# Altium schematic sheet Debug.SchDoc
size Letter; SheetNumber: 11; SheetTotal: 11
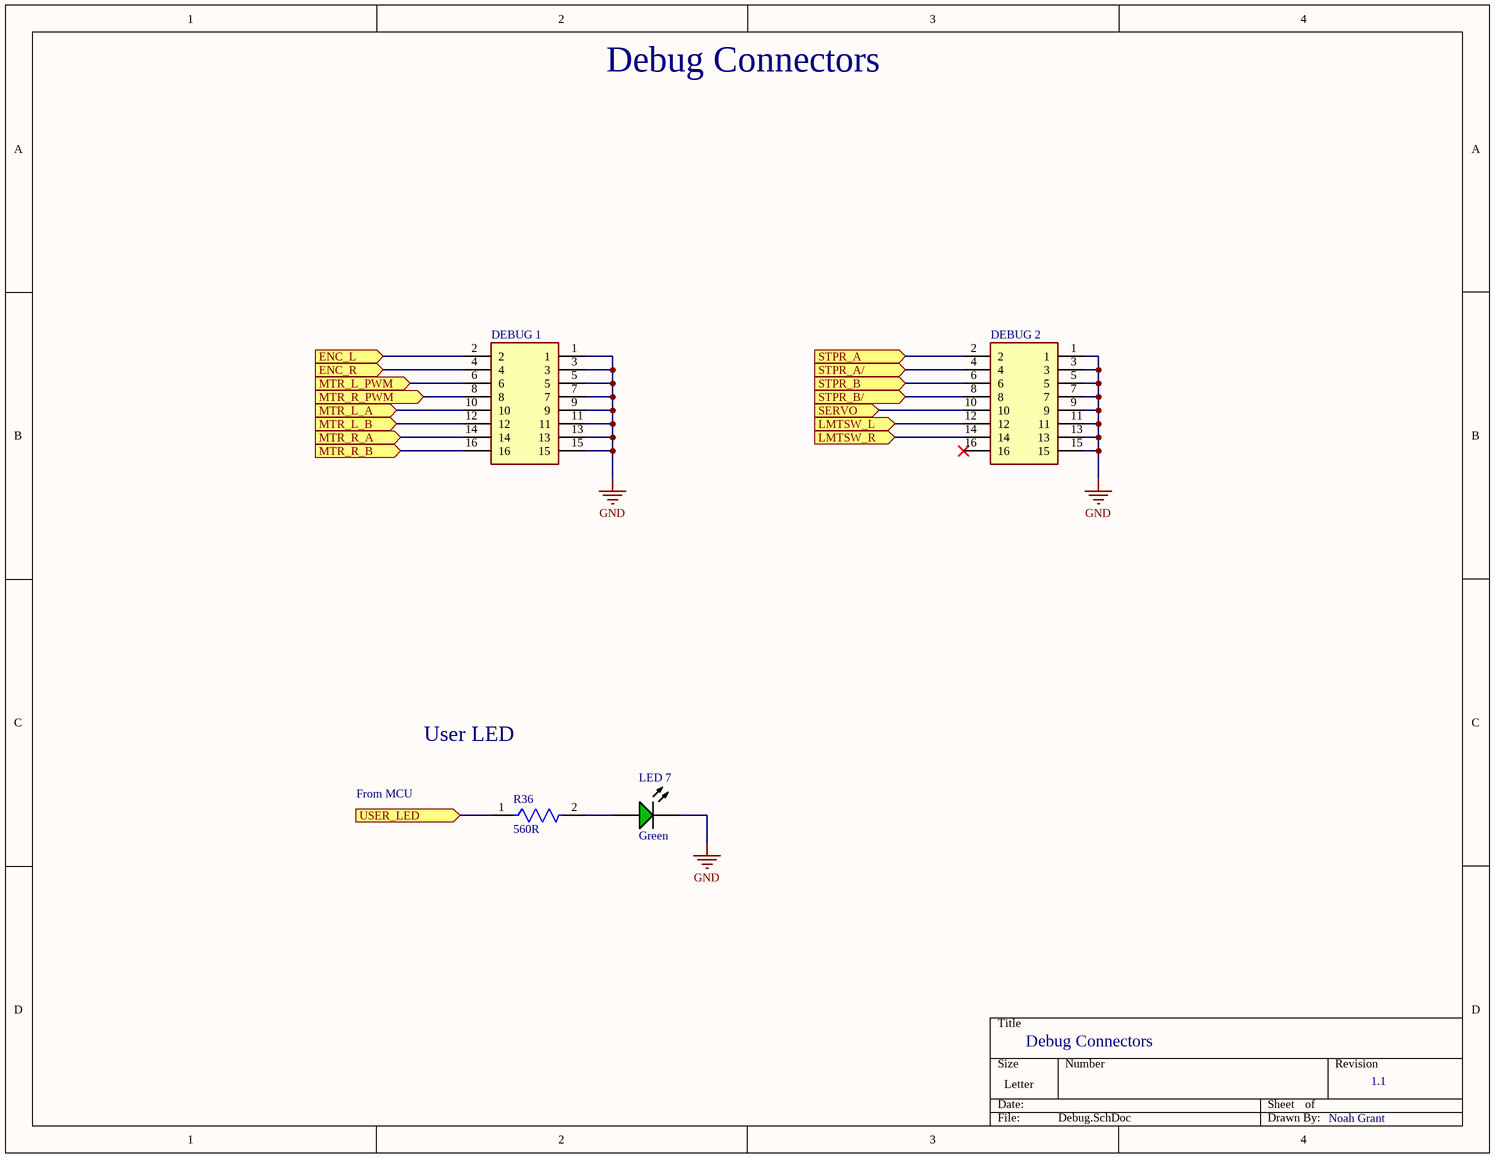
[diagram p0: Debug.SchDoc]

## Parts
DEBUG_1  3020-16-0300-00  [302016030000]  (value not drawn)
DEBUG_2  3020-16-0300-00  [302016030000]  (value not drawn)
LED_7  Green  [AVAG-HSMX-C190_V]
R36  560R  [FP-CPF0603-MFG]

## Ports
ENC_L (in, see Top_Sheet[2D], DCMTR_ENC[2B], Nucleo[2C]), ENC_R (in, see Top_Sheet[2D], DCMTR_ENC[1A], Nucleo[2C]), LMTSW_L (in, see Top_Sheet[2D], Nucleo[4B], STPR_LMTSW_SRV[2C]), LMTSW_R (in, see Top_Sheet[3D], Nucleo[4B], STPR_LMTSW_SRV[2D]), MTR_L_A (in, see Top_Sheet[2D], DCMTR_ENC[3C], Nucleo[1B]), MTR_L_B (in, see Top_Sheet[2D], DCMTR_ENC[3C], Nucleo[1C]), MTR_L_PWM (in, see Top_Sheet[2D], DCMTR_ENC[3C], Nucleo[1B]), MTR_R_A (in, see Top_Sheet[2D], DCMTR_ENC[3C], Nucleo[4B]), MTR_R_B (in, see Top_Sheet[2D], DCMTR_ENC[3C], Nucleo[3B]), MTR_R_PWM (in, see Top_Sheet[2D], DCMTR_ENC[3C], Nucleo[2B]), SERVO (in, see Top_Sheet[3D], Nucleo[4C], STPR_LMTSW_SRV[3C]), STPR_A (in, see Top_Sheet[3D], Nucleo[2C], STPR_LMTSW_SRV[1B]), STPR_A/ (in, see Top_Sheet[3D], Nucleo[2C], STPR_LMTSW_SRV[1B]), STPR_B (in, see Top_Sheet[3D], Nucleo[1C], STPR_LMTSW_SRV[1B]), STPR_B/ (in, see Top_Sheet[3D], Nucleo[1C], STPR_LMTSW_SRV[1B]), USER_LED (in, see Top_Sheet[3D], Nucleo[1C])

## Nets
GND: DEBUG_1.1 DEBUG_1.3 DEBUG_1.5 DEBUG_1.7 DEBUG_1.9 DEBUG_1.11 DEBUG_1.13 DEBUG_1.15 DEBUG_2.1 DEBUG_2.3 DEBUG_2.5 DEBUG_2.7 DEBUG_2.9 DEBUG_2.11 DEBUG_2.13 DEBUG_2.15 LED_7.2(K)
ENC_L: DEBUG_1.2 ; port ENC_L
ENC_R: DEBUG_1.4 ; port ENC_R
LMTSW_L: DEBUG_2.12 ; port LMTSW_L
LMTSW_R: DEBUG_2.14 ; port LMTSW_R
MTR_L_A: DEBUG_1.10 ; port MTR_L_A
MTR_L_B: DEBUG_1.12 ; port MTR_L_B
MTR_L_PWM: DEBUG_1.6 ; port MTR_L_PWM
MTR_R_A: DEBUG_1.14 ; port MTR_R_A
MTR_R_B: DEBUG_1.16 ; port MTR_R_B
MTR_R_PWM: DEBUG_1.8 ; port MTR_R_PWM
SERVO: DEBUG_2.10 ; port SERVO
STPR_A: DEBUG_2.2 ; port STPR_A
STPR_A/: DEBUG_2.4 ; port STPR_A/
STPR_B: DEBUG_2.6 ; port STPR_B
STPR_B/: DEBUG_2.8 ; port STPR_B/
USER_LED: R36.1 ; port USER_LED
NetLED_7_1: LED_7.1(A) R36.2

Not connected (* = marked no-connect by the designer): DEBUG_2 16*

## Notes on the sheet
- Debug Connectors
- User LED
- From MCU
- 1.1
- Noah Grant

## Library data of the parts
DEBUG_1 DEBUG_2 = 3020-16-0300-00: Connector; Manufacturer_Name: CNC Tech; Datasheet Link: http://cnctech.us/pdfs/3020-XX-0300-00.pdf; Height: 9.95mm; Manufacturer_Part_Number: 3020-16-0300-00; Arrow Part Number: 3020-16-0300-00; Arrow Price/Stock: https://www.arrow.com/en/products/3020-16-0300-00/cnc-tech-llc?region=nac
LED_7 = CMP-1744-00002-1: Chip LED, Green, 2.2 V, -40 to 85 degC, 2-Pin SMD, RoHS, Tape and Reel; Frequency: 400 KHz; Max Supply Voltage: 5.5 V; Access Time: 3500 ns; Clock Frequency: 100 KHz; Case\Package: SOIC; Density: 32 kb; Nominal Supply Current: 2 mA; Interface: Serial; Min Supply Voltage: 1.7 V; Packaging: Tape and Reel; PackageReference: HSMX-C190; ComponentLink2URL: http://docs.avagotech.com/docs/AV02-0551EN; RoHSCompliant: true; Pins: 8; REACH SVHC: No SVHC; Max Operating Temperature: 85 degC; Width: 4 mm; Radiation Hardening: No; Package Quantity: 3000; ComponentLink3Description: Package Specification; ComponentLink1Description: Manufacturer URL; Min Operating Temperature: -40 degC; PackageDescription: 2-Pin Surface Mount Device, Body 1.6 x 0.8 mm, Height 0.9 mm; Max Clock Frequency: 100 KHz; Height: 1.5 mm; ComponentLink1URL: http://www.avagotech.com/; DatasheetVersion: Mar-12; ComponentLink2Description: Datasheet; Mount: Surface Mount; Length: 5 mm; ComponentLink3URL: http://www.fairchildsemi.com/dwg/MA/MA03D.pdf
R36 = CMP-03211-007342-1: RES SMD 560Ω 0.1% 1/16W 0603; Manufacturer Part Number: CPF0603B560RE1; Manufacturer: TE Connectivity; Temperature Coefficient: 25ppm/°C; Voltage Rating: 50V; Power Rating: 0.063W; Lead Free: Yes; Automotive: No; Octopart: https://octopart.com/cpf0603b560re1-te+connectivity-9539416; Temperature Range High: +155°C; Device Class L2: Resistors; Temperature Range Low: -55°C; Composition: Thin Film; RoHS: TRUE; ComponentLink2URL: https://www.te.com/commerce/DocumentDelivery/DDEController?Action=showdoc&DocId=Data+Sheet%7F1773200%7FM%7Fpdf%7FEnglish%7FENG_DS_1773200_M.pdf%7F3-1676481-2; Temperature: -55°C to +155°C; Device Class L1: Passive Components; Resistance: 560Ω; Height: 0.55mm; Series: CPF; octopart_url: https://octopart.com/cpf0603b560re1-te+connectivity-9539416; Category: Res; Tolerance: 0.1%; ComponentLink2Description: Datasheet; packaging: 1k Reel; Package: CPF0603; Device Class L3: Chip SMD Resistors; Value: 560Ω; Ipc Land Pattern Name: RESC15580X45